# EAGLE design MicroBit Robot Interface RevA (EAGLE 7.5.0)
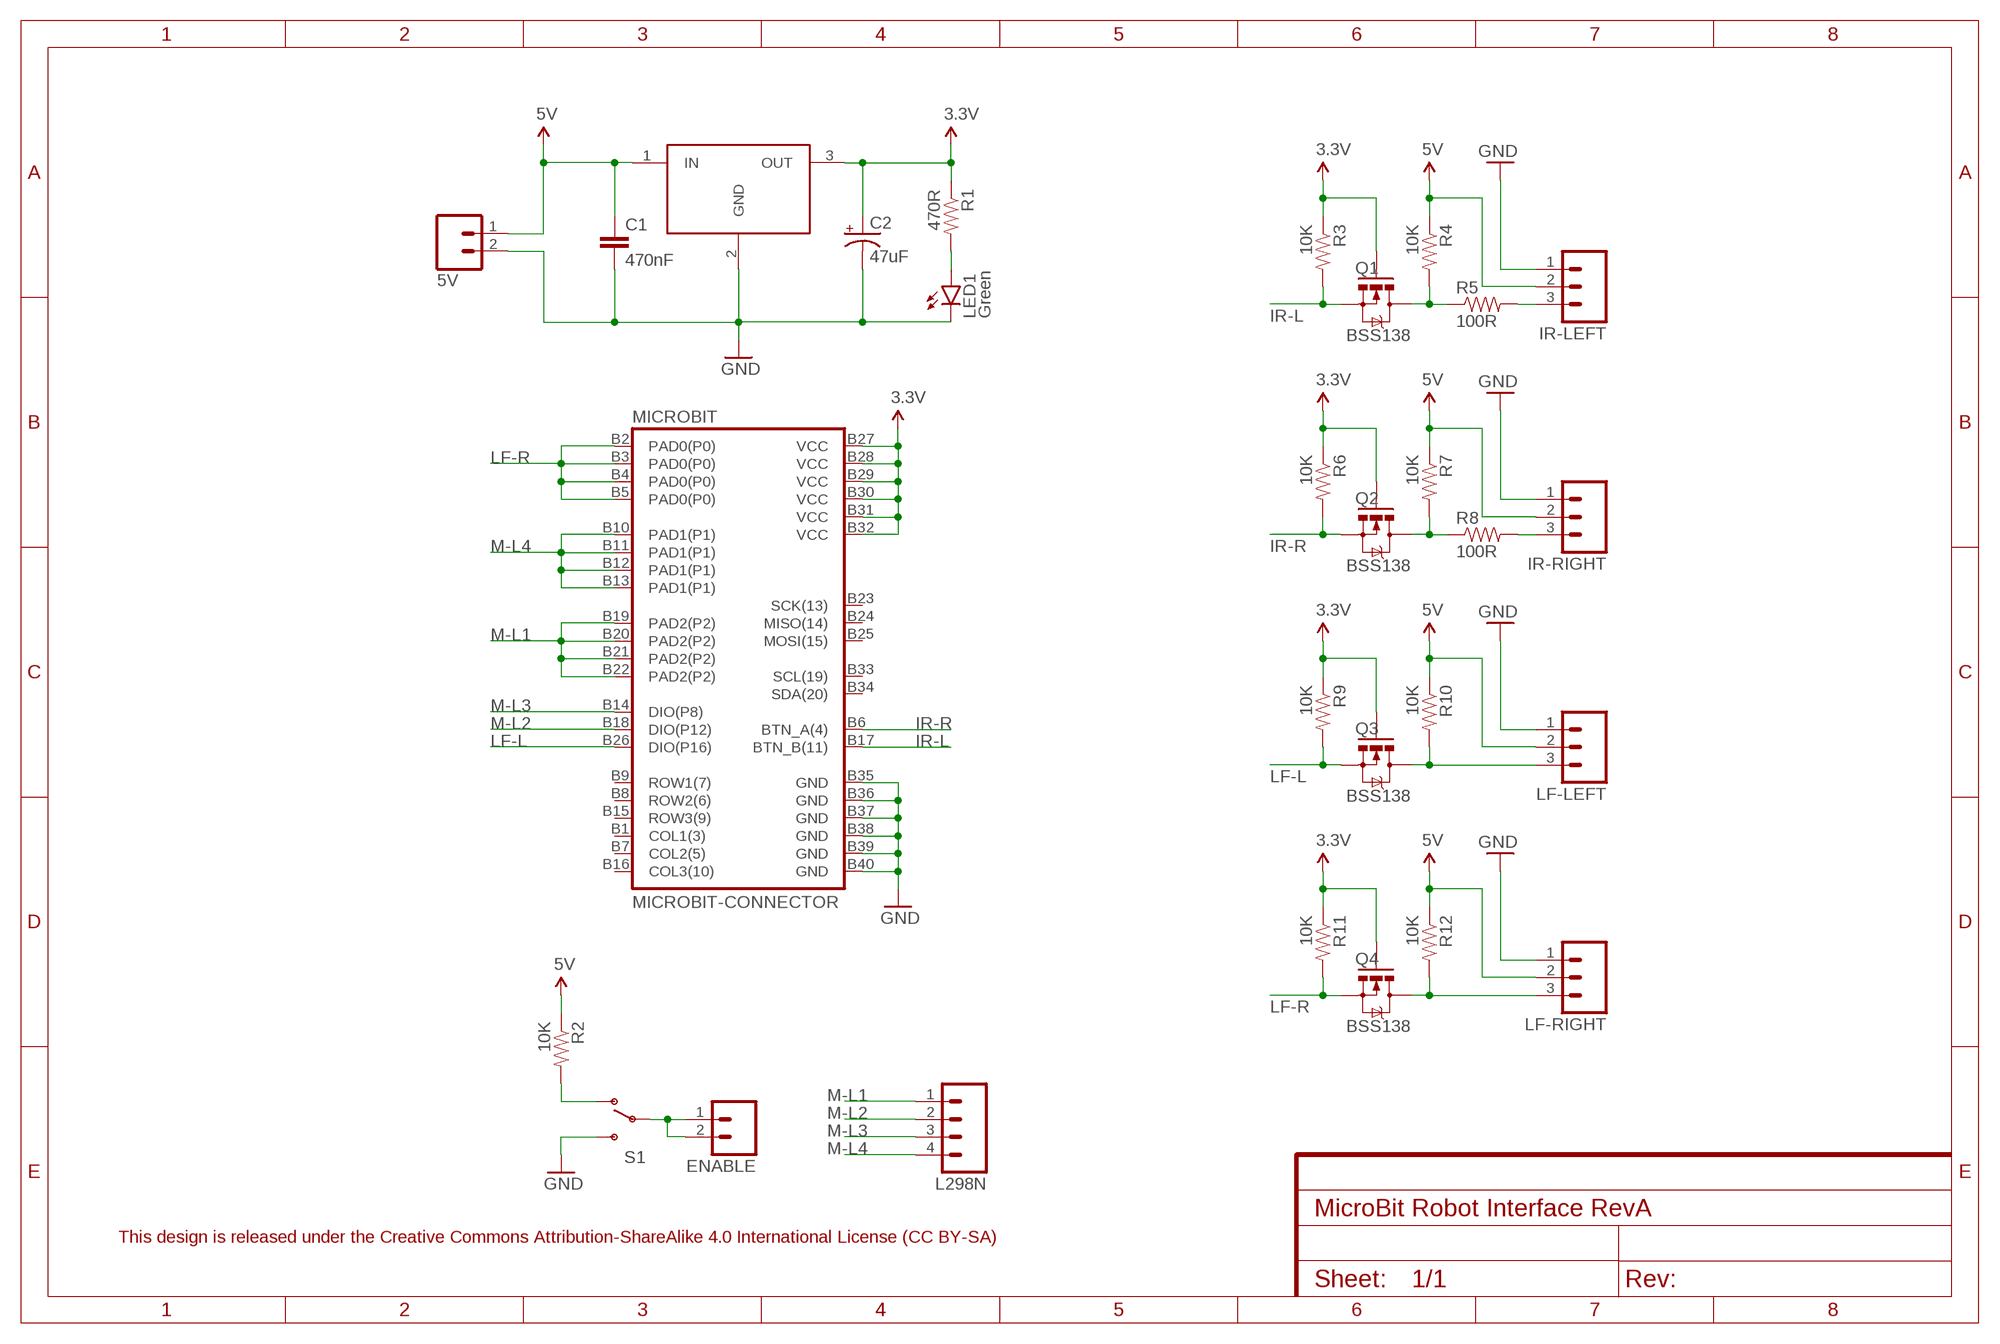
[diagram p0: schematic, sheet 1]
FRAME1 (FRAME-A4L): CNAME: MicroBit Robot Interface Board; CREVISION: A 01/2016; DESIGNER: A J Instone-Cowie

## Parts
5V  MCOMP_SCREWTERM_2PIN5MM  [MCOMP-SCREWTERMINAL-5MM-2]
C1  470nF  CAP0603-CAP  [0603-CAP]
C2  47uF  CAP_POLPTH1  [CPOL-RADIAL-100UF-25V]
ENABLE  M02PTH  [1X02]
IR-LEFT  M03PTH  [1X03]
IR-RIGHT  M03PTH  [1X03]
L298N  M04PTH  [1X04]
LED1  Green  LED3MM  [LED3MM]
LF-LEFT  M03PTH  [1X03]
LF-RIGHT  M03PTH  [1X03]
MICROBIT  MICROBIT-CONNECTOR  [RBB40DHHN_MICROBIT]
Q1  BSS138  MOSFET-NCHANNELBSS138  [SOT23-3]
Q2  BSS138  MOSFET-NCHANNELBSS138  [SOT23-3]
Q3  BSS138  MOSFET-NCHANNELBSS138  [SOT23-3]
Q4  BSS138  MOSFET-NCHANNELBSS138  [SOT23-3]
R1  470R  RESISTOR0603-RES  [0603-RES]
R2  10K  RESISTOR0603-RES  [0603-RES]
R3  10K  RESISTOR0603-RES  [0603-RES]
R4  10K  RESISTOR0603-RES  [0603-RES]
R5  100R  RESISTOR0603-RES  [0603-RES]
R6  10K  RESISTOR0603-RES  [0603-RES]
R7  10K  RESISTOR0603-RES  [0603-RES]
R8  100R  RESISTOR0603-RES  [0603-RES]
R9  10K  RESISTOR0603-RES  [0603-RES]
R10  10K  RESISTOR0603-RES  [0603-RES]
R11  10K  RESISTOR0603-RES  [0603-RES]
R12  10K  RESISTOR0603-RES  [0603-RES]
S1  KNITTER-SWITCH-MFP106D  [KNITTER-SWITCH-MFP106D]
VR1  LM3940IMP-3.3  [SOT223]

## Nets
3.3V: C2.1(+) MICROBIT.B27(VCC) MICROBIT.B28(VCC) MICROBIT.B29(VCC) MICROBIT.B30(VCC) MICROBIT.B31(VCC) MICROBIT.B32(VCC) Q1.1(G) Q2.1(G) Q3.1(G) Q4.1(G) R1.1 R3.1 R6.1 R9.1 R11.1 VR1.3(OUT)
5V: 5V.1 C1.1 IR-LEFT.2 IR-RIGHT.2 LF-LEFT.2 LF-RIGHT.2 R2.1 R4.1 R7.1 R10.1 R12.1 VR1.1(IN)
GND: 5V.2 C1.2 C2.2(-) IR-LEFT.1 IR-RIGHT.1 LED1.K(C) LF-LEFT.1 LF-RIGHT.1 MICROBIT.B35(GND) MICROBIT.B36(GND) MICROBIT.B37(GND) MICROBIT.B38(GND) MICROBIT.B39(GND) MICROBIT.B40(GND) S1.P$2(POS2) VR1.2(GND)
IR-L: MICROBIT.B17(BTN_B(11)) Q1.2(S) R3.2
IR-R: MICROBIT.B6(BTN_A(4)) Q2.2(S) R6.2
LF-L: MICROBIT.B26(DIO(P16)) Q3.2(S) R9.2
LF-R: MICROBIT.B2(PAD0(P0)) MICROBIT.B3(PAD0(P0)) MICROBIT.B4(PAD0(P0)) MICROBIT.B5(PAD0(P0)) Q4.2(S) R11.2
M-L1: L298N.1 MICROBIT.B19(PAD2(P2)) MICROBIT.B20(PAD2(P2)) MICROBIT.B21(PAD2(P2)) MICROBIT.B22(PAD2(P2))
M-L2: L298N.2 MICROBIT.B18(DIO(P12))
M-L3: L298N.3 MICROBIT.B14(DIO(P8))
M-L4: L298N.4 MICROBIT.B10(PAD1(P1)) MICROBIT.B11(PAD1(P1)) MICROBIT.B12(PAD1(P1)) MICROBIT.B13(PAD1(P1))
N$1: Q2.3(D) R7.2 R8.1
N$2: LF-LEFT.3 Q3.3(D) R10.2
N$3: LF-RIGHT.3 Q4.3(D) R12.2
N$4: R2.2 S1.P$1(POS1)
N$5: IR-LEFT.3 R5.2
N$6: IR-RIGHT.3 R8.2
N$9: Q1.3(D) R4.2 R5.1
N$13: LED1.A R1.2
N$14: ENABLE.1 ENABLE.2 S1.WIPER(COMMON)
Unconnected: MICROBIT.B1(COL1(3)) MICROBIT.B7(COL2(5)) MICROBIT.B8(ROW2(6)) MICROBIT.B9(ROW1(7)) MICROBIT.B15(ROW3(9)) MICROBIT.B16(COL3(10)) MICROBIT.B23(SCK(13)) MICROBIT.B24(MISO(14)) MICROBIT.B25(MOSI(15)) MICROBIT.B33(SCL(19)) MICROBIT.B34(SDA(20))

## Notes on the sheet
- This design is released under the Creative Commons Attribution-ShareAlike 4.0 International License (CC BY-SA)

## Library data of the parts
5V = MicroBit_Custom:MCOMP_SCREWTERM_2PIN: 5mm Screw Terminal footprint, 2 way, for Multicomp MA522-500M02, Farnell 2396252
C1 = SparkFun-Passives:CAP: Capacitor Standard 0603 ceramic capacitor, and 0.1" leaded capacitor.
C2 = SparkFun-Passives:CAP_POL: Capacitor Polarized These are standard SMD and PTH capacitors. Normally 10uF, 47uF, and 100uF in electrolytic and tantalum varieties. Always verify the external diameter of the through hole cap, it varies with capacity, voltage, and manufacturer. The EIA devices should be standard.
ENABLE = SparkFun-Connectors:M02: Standard 2-pin 0.1" header. Use with - straight break away headers ( PRT-00116) - right angle break away headers (PRT-00553) - swiss pins (PRT-00743) - machine pins (PRT-00117) - female headers (PRT-00115) Molex polarized connector foot print use with: PRT-08233 with associated crimp pins and housings. 2.54_SCREWTERM for use with PRT-10571. 3.5mm Screw Terminal footprints for PRT-08084 5mm Screw Terminal footprints for use with PRT-08432
IR-LEFT IR-RIGHT LF-LEFT LF-RIGHT = SparkFun-Connectors:M03: Header 3 Standard 3-pin 0.1" header. Use with straight break away headers (SKU : PRT-00116), right angle break away headers (PRT-00553), swiss pins (PRT-00743), machine pins (PRT-00117), and female headers (PRT-00115). Molex polarized connector foot print use with SKU : PRT-08232 with associated crimp pins and housings.
L298N = SparkFun-Connectors:M04: Header 4 Standard 4-pin 0.1" header. Use with straight break away headers (SKU : PRT-00116), right angle break away headers (PRT-00553), swiss pins (PRT-00743), machine pins (PRT-00117), and female headers (PRT-00115). Molex polarized connector foot print use with SKU : PRT-08231 with associated crimp pins and housings. 1MM SMD Version SKU: PRT-10208
LED1 = SparkFun-LED:LED: LEDs Standard schematic elements and footprints for 5mm, 3mm, 1206, and 0603 sized LEDs. 5mm - Spark Fun Electronics SKU : COM-00529 (and others)
MICROBIT = MicroBit_Custom:MICROBIT-: Not yet complete or validated - DO NOT USE
Q1-Q4 = SparkFun-DiscreteSemi:MOSFET-NCHANNEL: Common NMOSFET Parts MFG P/N Store ID Prod ID FDD8780 TRANS-09984 SI7820DN TRANS-11055 FDS6630A IC-08089 2N7002PW TRANS-11151 FQP30N06L COM-10213 TRANS-10060 BSS123LT1G TRANS-08345 BSS138 TRANS-00830 BS170 2N7000; PROD_ID: TRANS-00830; VALUE: 200mA/50V
R1-R12 = SparkFun-Passives:RESISTOR: Resistor Basic schematic elements and footprints for 0603, 1206, and PTH resistors.
S1 = MicroBit_Custom:KNITTER-SWITCH-MFP106D: KNITTER-SWITCH MFP106D Slide Switch, SPDT, Vertical, Through Hole, 6 A, 250 V Manufacturer: KNITTER-SWITCH Farnell Order Code: 807527 RS Order Code 711-8381 Manufacturer Part No MFP106D
VR1 = LM3940:LM3940IMP-3.3: 1A Low Dropout Regulator for 5V to 3.3V Conversion

## Board
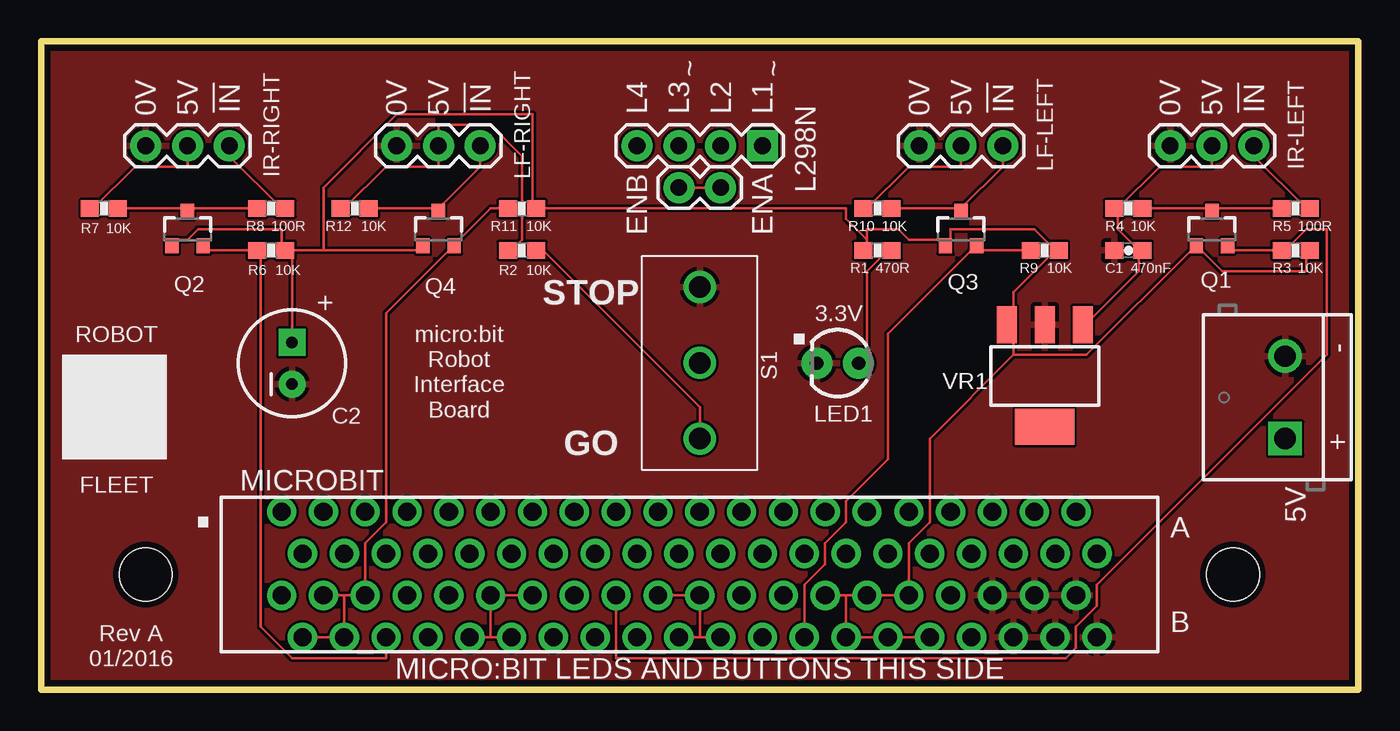
[diagram p1: board, top side]
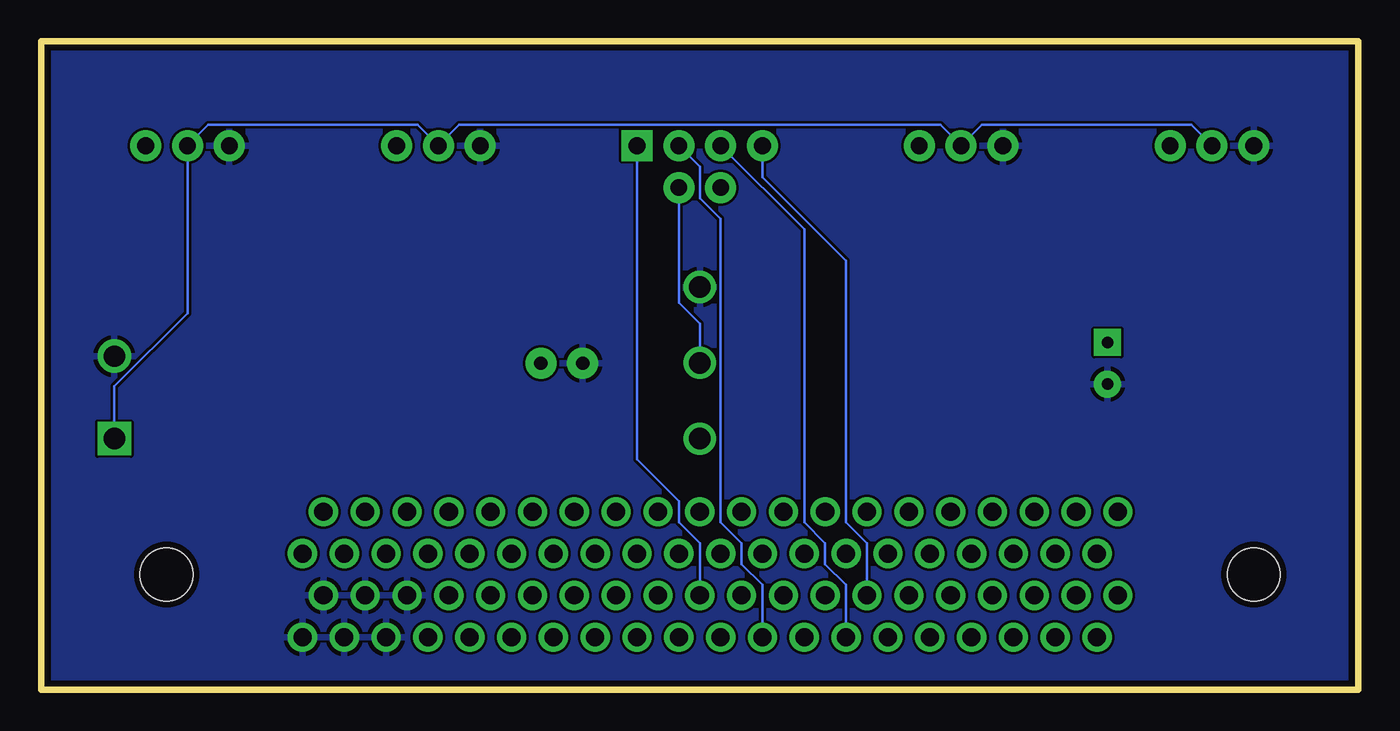
[diagram p2: board, bottom side, seen from below]

Size 80.01 x 39.37 mm. Coordinates in mm from the lower left corner, seen from the top.
Outline: 0,39.37 80.01,39.37 80.01,0 0,0 0,39.37
Copper layers (1*16): Top 0.0356mm / dielectric 1.5011mm / Bottom 0.0356mm
Design rules "LaenPCBOrder(OSHPARK)": minimum track width 6mil, minimum drill 13mil, track to track 6mil, track to pad 6mil, pad to pad 6mil, via to via 6mil, smd to smd 6mil, copper to edge 15mil, drill to drill 6mil, minimum pad ring 7mil, minimum via ring 7mil, stop-mask expansion 3mil, vias tented up to drill 0mil, thermal gap 10mil
Holes 3.2 mm at 6.35,6.99 72.39,6.99

### Footprints (pad centres in the part's own frame; a part is rotated, then mirrored left to right if it is on the bottom)
MCOMP-SCREWTERMINAL-5MM-2 = drill 1.3 pad 2.032 square: 1 0,0 | drill 1.3 pad 2.032: 2 5,0
0603-CAP = smd 1.1 x 1: 1 -0.85,0; 2 0.85,0
CPOL-RADIAL-100UF-25V = drill 0.7 pad 1.651 square: 1 1.27,0 | drill 0.7 pad 1.651: 2 -1.27,0
1X02 = drill 1.016 pad 1.88: 1 0,0; 2 2.54,0
1X03 = drill 1.016 pad 1.88: 1 0,0; 2 2.54,0; 3 5.08,0
1X04 = drill 1.016 pad 1.88 square: 1 0,0 | drill 1.016 pad 1.88: 2 2.54,0; 3 5.08,0; 4 7.62,0
LED3MM = drill 0.813 pad 1.88: A -1.27,0; K 1.27,0
RBB40DHHN_MICROBIT = drill 1.1 pad 1.778: A1 -25.4,3.81; A2 -24.13,1.27; A3 -22.86,3.81; A4 -21.59,1.27; A5 -20.32,3.81; A6 -19.05,1.27; A7 -17.78,3.81; A8 -16.51,1.27; A9 -15.24,3.81; A10 -13.97,1.27; A11 -12.7,3.81; A12 -11.43,1.27; A13 -10.16,3.81; A14 -8.89,1.27; A15 -7.62,3.81; A16 -6.35,1.27; A17 -5.08,3.81; A18 -3.81,1.27; A19 -2.54,3.81; A20 -1.27,1.27; A21 0,3.81; A22 1.27,1.27; A23 2.54,3.81; A24 3.81,1.27; A25 5.08,3.81; A26 6.35,1.27; A27 7.62,3.81; A28 8.89,1.27; A29 10.16,3.81; A30 11.43,1.27; A31 12.7,3.81; A32 13.97,1.27; A33 15.24,3.81; A34 16.51,1.27; A35 17.78,3.81; A36 19.05,1.27; A37 20.32,3.81; A38 21.59,1.27; A39 22.86,3.81; A40 24.13,1.27; B1 -25.4,-1.27; B2 -24.13,-3.81; B3 -22.86,-1.27; B4 -21.59,-3.81; B5 -20.32,-1.27; B6 -19.05,-3.81; B7 -17.78,-1.27; B8 -16.51,-3.81; B9 -15.24,-1.27; B10 -13.97,-3.81; B11 -12.7,-1.27; B12 -11.43,-3.81; B13 -10.16,-1.27; B14 -8.89,-3.81; B15 -7.62,-1.27; B16 -6.35,-3.81; B17 -5.08,-1.27; B18 -3.81,-3.81; B19 -2.54,-1.27; B20 -1.27,-3.81; B21 0,-1.27; B22 1.27,-3.81; B23 2.54,-1.27; B24 3.81,-3.81; B25 5.08,-1.27; B26 6.35,-3.81; B27 7.62,-1.27; B28 8.89,-3.81; B29 10.16,-1.27; B30 11.43,-3.81; B31 12.7,-1.27; B32 13.97,-3.81; B33 15.24,-1.27; B34 16.51,-3.81; B35 17.78,-1.27; B36 19.05,-3.81; B37 20.32,-1.27; B38 21.59,-3.81; B39 22.86,-1.27; B40 24.13,-3.81
SOT23-3 = smd 0.8 x 0.9: 1 -0.95,-1; 2 0.95,-1; 3 0,1.1
0603-RES = smd 1.1 x 1: 1 -0.85,0; 2 0.85,0
KNITTER-SWITCH-MFP106D = drill 1.3: P$1 0,0; P$2 9.2,0; WIPER 4.6,0
SOT223 = smd 1.219 x 2.235: 1 -2.311,-3.099; 2 0,-3.099; 3 2.311,-3.099 | smd 3.6 x 2.2: 4 0,3.099

### Placement (x,y rotation side)
5V  75.56,15.24 90 top
C1  66.04,26.67 180 top
C2  15.24,19.81 90 top
ENABLE  41.27,30.48 180 top
IR-LEFT  68.58,33.02 0 top
IR-RIGHT  6.35,33.02 0 top
L298N  43.81,33.02 180 top
LED1  48.39,19.81 180 top
LF-LEFT  53.34,33.02 0 top
LF-RIGHT  21.59,33.02 0 top
MICROBIT  40,6.99 0 top
Q1  71.12,27.94 0 top
Q2  8.89,27.94 0 top
Q3  55.88,27.94 0 top
Q4  24.13,27.94 0 top
R1  50.8,26.67 0 top
R2  29.21,26.67 0 top
R3  76.2,26.67 180 top
R4  66.04,29.21 0 top
R5  76.2,29.21 0 top
R6  13.97,26.67 180 top
R7  3.81,29.21 0 top
R8  13.97,29.21 0 top
R9  60.96,26.67 180 top
R10  50.8,29.21 0 top
R11  29.21,29.21 180 top
R12  19.05,29.21 0 top
S1  40,15.24 90 top
VR1  60.96,19.05 180 top

### Tracks (layer width: path | path; a pad name or v marks a point on that pad's centre or on a via)
3.3V
  Top 0.152: MICROBIT.B32 MICROBIT.B30 MICROBIT.B28 48.89,5.71 | 48.89,5.71 MICROBIT.B29 MICROBIT.B31 52.7,8.89 53.97,10.16 53.97,15.24 59.05,20.32 | 48.89,5.71 MICROBIT.B27 | R3.1 76.83,26.67 76.83,25.4 71.75,25.4 70.48,26.67 Q1.1 69.85,26.67 63.5,20.32 59.05,20.32 | 61.59,26.67 59.05,24.13 59.05,22.23 VR1.3 59.05,21.59 59.05,20.32 | Q2.1 8.25,27.3 8.89,27.3 9.53,27.94 14.6,27.94 14.6,26.67 R6.1 15.24,26.67 | 15.24,26.67 17.14,26.67 | 17.14,26.67 22.86,26.67 Q4.1 | 15.24,26.67 C2.1 | 50.16,27.3 50.16,26.67 R1.1 | 50.16,27.3 50.16,27.94 52.07,27.94 52.7,27.3 54.61,27.3 Q3.1 55.24,27.3 55.24,27.94 60.33,27.94 61.59,26.67 | 50.16,27.3 48.89,28.57 48.89,29.21 R11.1 29.85,29.21 29.85,34.92 21.59,34.92 17.14,30.48 17.14,26.67 | 61.59,26.67 R9.1
5V
  Top 0.152: 66.67,26.67 65.41,27.94 65.41,29.21 | 66.67,26.67 66.67,25.4 63.5,22.23 VR1.1 | 66.67,26.67 C1.1 | IR-RIGHT.2 8.89,31.75 5.71,31.75 3.18,29.21 R7.1 | R12.1 18.42,29.21 20.96,31.75 24.13,31.75 LF-RIGHT.2 24.13,34.29 27.3,34.29 29.21,32.38 29.21,27.3 28.57,26.67 R2.1 | LF-LEFT.2 55.88,31.75 52.7,31.75 50.16,29.21 R10.1 | 65.41,29.21 67.94,31.75 71.12,31.75 IR-LEFT.2 | 65.41,29.21 R4.1
  Bottom 0.152: IR-RIGHT.2 10.16,34.29 22.86,34.29 LF-RIGHT.2 25.4,34.29 54.61,34.29 LF-LEFT.2 57.15,34.29 69.85,34.29 IR-LEFT.2 71.12,22.86 75.56,18.41 5V.1
GND
  pour Bottom: 0,39.37 80.01,39.37 80.01,0 0,0
  pour Top: 0,39.37 80.01,39.37 80.01,0 0,0
IR-L
  Top 0.152: Q1.2 72.39,26.67 R3.2 75.56,26.67 76.83,27.94 78.11,27.94 78.11,20.32 64.13,6.35 64.13,5.08 62.86,3.81 62.86,2.54 62.23,1.91 34.92,1.91 MICROBIT.B17
IR-R
  Top 0.152: Q2.2 10.16,26.67 R6.2 13.33,26.67 13.33,3.81 15.24,1.91 20.96,1.91 MICROBIT.B6
LF-L
  Top 0.152: R9.2 57.15,26.67 Q3.2 56.52,26.67 51.43,21.59 51.43,13.97 48.89,11.43 48.89,10.16 47.62,8.89 47.62,7.62 46.35,6.35 MICROBIT.B26
LF-R
  Top 0.152: MICROBIT.B2 MICROBIT.B4 18.42,5.71 | R11.2 27.3,29.21 25.4,27.3 Q4.2 24.77,26.67 20.96,22.86 20.96,10.16 19.69,8.89 MICROBIT.B5 18.42,5.71 | 18.42,5.71 MICROBIT.B3
M-L1
  Top 0.152: MICROBIT.B19 MICROBIT.B21 40,3.17 | MICROBIT.B22 40,3.17 | 40,3.17 MICROBIT.B20
  Bottom 0.152: L298N.1 43.81,13.97 41.27,11.43 41.27,10.16 40,8.89 MICROBIT.B21
M-L2
  Bottom 0.152: MICROBIT.B18 36.2,6.35 37.46,7.62 37.46,8.89 38.73,10.16 38.73,28.57 40,29.84 40,31.75 L298N.2
M-L3
  Bottom 0.152: MICROBIT.B14 31.11,6.35 32.38,7.62 32.38,8.89 33.66,10.16 33.66,27.94 L298N.3
M-L4
  Top 0.152: MICROBIT.B13 MICROBIT.B11 27.3,3.17 | MICROBIT.B12 27.3,3.17 | 27.3,3.17 MICROBIT.B10
  Bottom 0.152: L298N.4 36.2,31.11 31.11,26.04 31.11,10.16 29.85,8.89 MICROBIT.B13
N$1
  Top 0.152: R7.2 8.89,29.21 | 8.89,29.21 R8.1 | 8.89,29.21 Q2.3
N$2
  Top 0.152: R10.2 55.88,29.21 | 55.88,29.21 58.42,31.75 LF-LEFT.3 | 55.88,29.21 Q3.3
N$3
  Top 0.152: R12.2 24.13,29.21 | 24.13,29.21 26.67,31.75 LF-RIGHT.3 | 24.13,29.21 Q4.3
N$4
  Top 0.152: S1.P$1 40,17.14 30.48,26.67 R2.2
N$5
  Top 0.152: IR-LEFT.3 73.66,32.38 76.83,29.21 R5.2
N$6
  Top 0.152: IR-RIGHT.3 11.43,32.38 14.6,29.21 R8.2
N$9
  Top 0.152: R4.2 71.12,29.21 | 71.12,29.21 R5.1 | 71.12,29.21 Q1.3
N$13
  Top 0.152: R1.2 51.43,26.67 50.16,25.4 50.16,20.32 LED1.A
N$14
  Top 0.152: ENABLE.1 ENABLE.2
  Bottom 0.152: S1.WIPER 40,22.23 41.27,23.5 ENABLE.1

### Text on the board
tPlace: ~ / / ~ | 0V / 5V / !IN! | 0V / 5V / !IN! | L4 / L3 / L2 / L1 | 0V / 5V / !IN! | 0V / 5V / !IN! | ENB / / / ENA | + | 3.3V | STOP / / / GO | + - | ROBOT / / / / / / FLEET | micro:bit / Robot / Interface / Board | Rev A / 01/2016